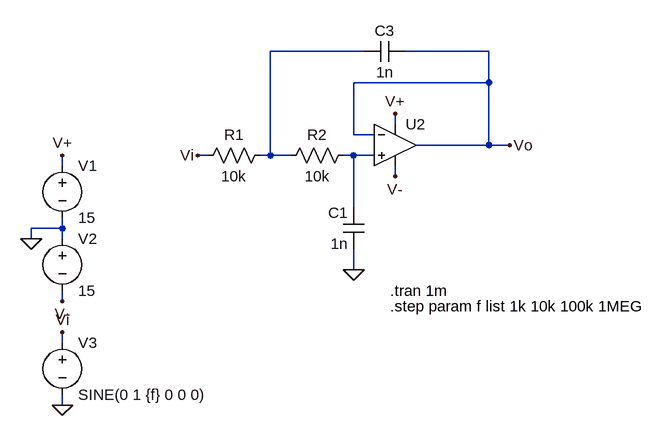
[diagram p0: schematic lab5_5.asc]
lab5_5.asc, the LTspice schematic file:
Version 4
SHEET 1 948 680
WIRE 512 96 368 96
WIRE 704 96 576 96
WIRE 704 144 704 96
WIRE 704 144 496 144
WIRE 560 208 560 192
WIRE 496 224 496 144
WIRE 528 224 496 224
WIRE 704 240 704 144
WIRE 704 240 592 240
WIRE 736 240 704 240
WIRE 272 256 256 256
WIRE 368 256 368 96
WIRE 368 256 352 256
WIRE 400 256 368 256
WIRE 496 256 480 256
WIRE 528 256 496 256
WIRE 48 272 48 256
WIRE 560 288 560 272
WIRE 496 336 496 256
WIRE 48 368 48 352
WIRE 48 368 0 368
WIRE 0 384 0 368
WIRE 48 384 48 368
WIRE 496 432 496 400
WIRE 48 480 48 464
WIRE 48 544 48 528
WIRE 48 640 48 624
FLAG 48 256 V+
FLAG 48 480 V-
FLAG 48 528 Vi
FLAG 48 640 0
FLAG 0 384 0
FLAG 256 256 Vi
FLAG 496 432 0
FLAG 736 240 Vo
FLAG 560 192 V+
FLAG 560 288 V-
SYMBOL voltage 48 256 R0
SYMATTR InstName V1
SYMATTR Value 15
SYMBOL voltage 48 368 R0
SYMATTR InstName V2
SYMATTR Value 15
SYMBOL voltage 48 528 R0
SYMATTR InstName V3
SYMATTR Value SINE(0 1 {f} 0 0 0)
SYMATTR Value2 AC 1
SYMBOL Res 368 240 R90
WINDOW 0 0 56 VBottom 2
WINDOW 3 32 56 VTop 2
SYMATTR InstName R1
SYMATTR Value 10k
SYMBOL Cap 512 400 R180
WINDOW 0 24 56 Left 2
WINDOW 3 24 8 Left 2
SYMATTR InstName C1
SYMATTR Value 1n
SYMBOL Res 496 240 R90
WINDOW 0 0 56 VBottom 2
WINDOW 3 32 56 VTop 2
SYMATTR InstName R2
SYMATTR Value 10k
SYMBOL Cap 576 80 R90
WINDOW 0 0 32 VBottom 2
WINDOW 3 32 32 VTop 2
SYMATTR InstName C3
SYMATTR Value 1n
SYMBOL OpAmps/UniversalOpAmp2 560 240 R0
SYMATTR InstName U2
TEXT 552 464 Left 2 !.tran 1m
TEXT 552 488 Left 2 !.step param f list 1k 10k 100k 1MEG

The netlist it stands for:
* lab5_5.asc
V1 V+ 0 15
V2 0 V- 15
V3 Vi 0 SINE(0 1 {f} 0 0 0) AC 1
R1 N001 Vi 10k
C1 0 N002 1n
R2 N002 N001 10k
C3 Vo N001 1n
XU2 N002 Vo V+ V- Vo level2 Avol=1Meg GBW=10Meg Slew=10Meg Ilimit=25m Rail=0 Vos=0 En=0 Enk=0 In=0 Ink=0 Rin=500Meg  ; pins In+ In- V+ V- OUT
.tran 1m
.step param f list 1k 10k 100k 1MEG
.lib UniversalOpAmp2.lib
.backanno
.end